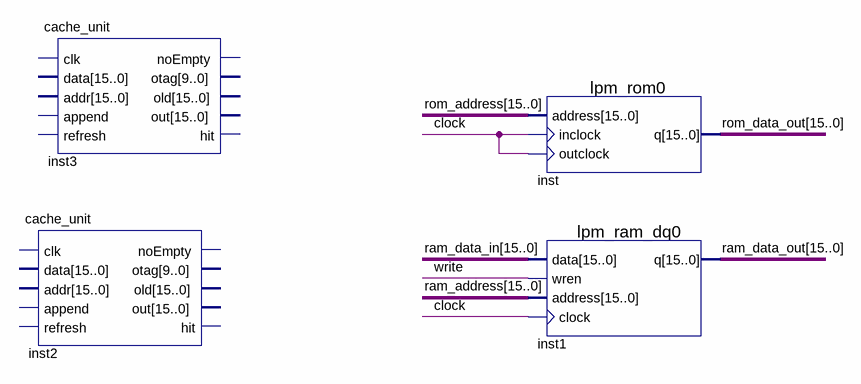
[diagram p0: schematic sheet]
// Quartus schematic SiFOVM_KP.bdf as structural Verilog: 4 symbols, 0 pins
module SiFOVM_KP (
);

  wire clock, write;
  wire [15:0] ram_address, ram_data_in, ram_data_out, rom_address, rom_data_out;

  cache_unit inst2 ();  // open: clk, data, addr, append, refresh, noEmpty, otag, old, out, hit
  cache_unit inst3 ();  // open: clk, data, addr, append, refresh, noEmpty, otag, old, out, hit
  lpm_rom0 inst (.address(rom_address), .inclock(clock), .outclock(clock), .q(rom_data_out));
  lpm_ram_dq0 inst1 (.data(ram_data_in), .wren(write), .address(ram_address), .clock(clock), .q(ram_data_out));
endmodule
